# Altium project Digital-WeighingScale.PrjPcb
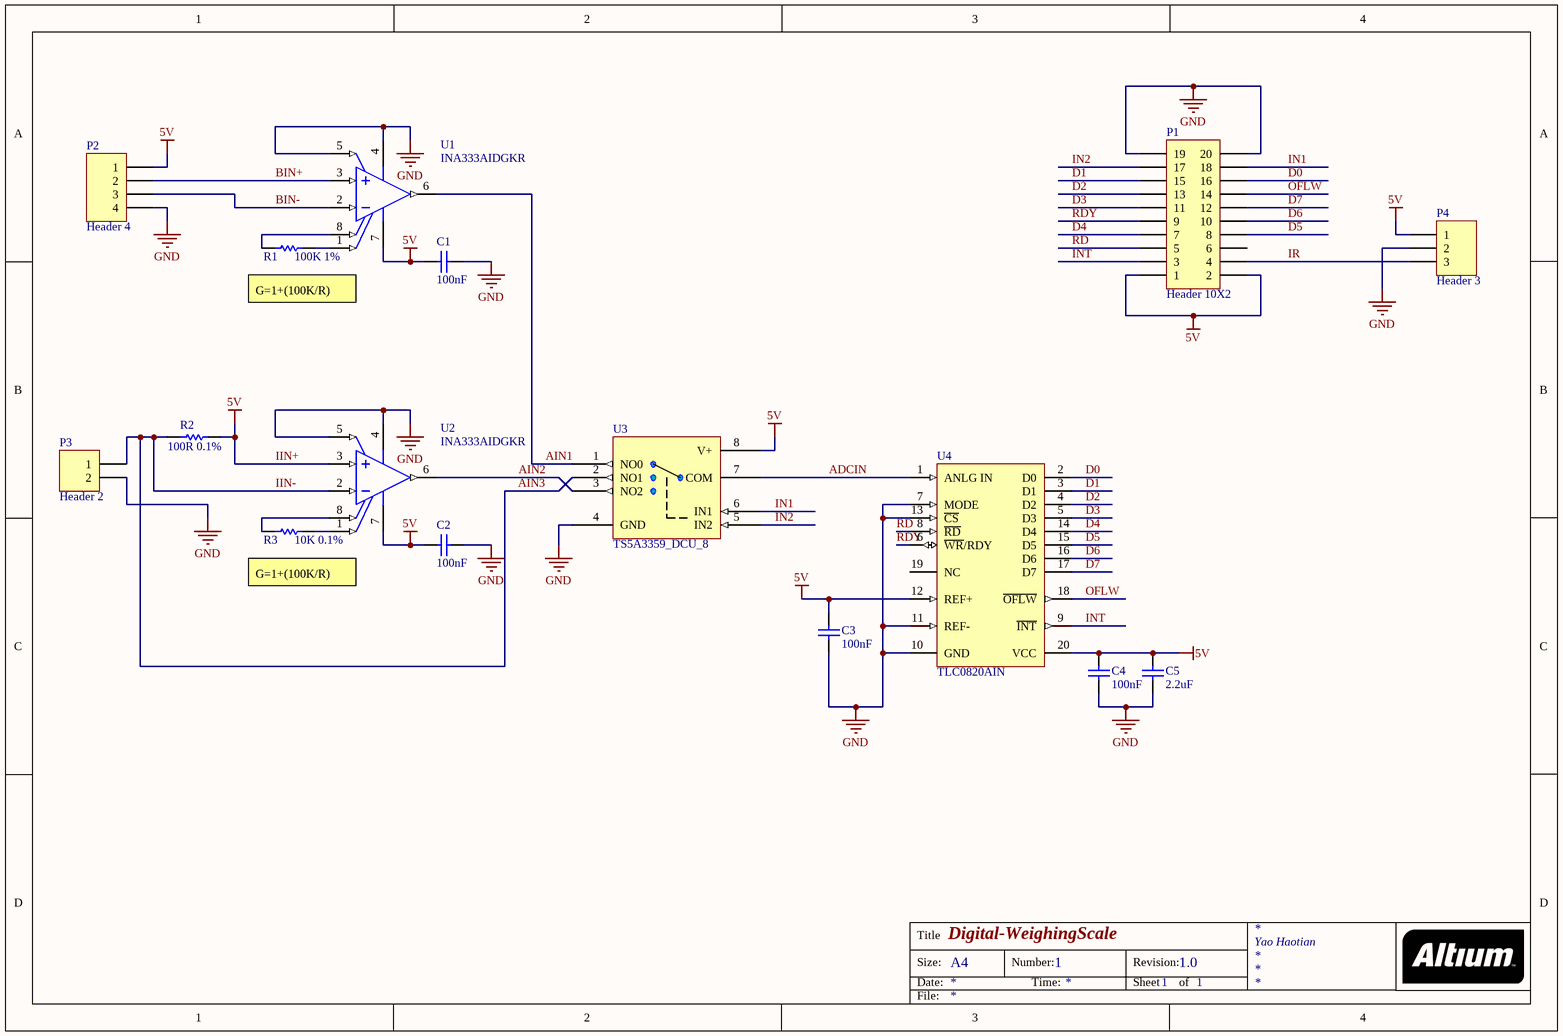
[diagram p0: Digital-WeighingScale.SchDoc]
1 sheet, 16 parts. Net scope: global (net labels, ports and power ports of the same name join across sheets).
Board file: Digital-WeighingScale.PcbDoc

## Sheet Digital-WeighingScale.SchDoc: Digital-WeighingScale
size A4; DrawnBy: Yao Haotian; Address1: Yao Haotian; DocumentNumber: 1; Revision: 1.0; SheetNumber: 1; SheetTotal: 1; ProjectName: Digital-WeighingScale

### Parts
C1  100nF  [CAPC0603(1608)100_M]
C2  100nF  [CAPC0603(1608)100_M]
C3  100nF  [CAPC0603(1608)100_M]
C4  100nF  [CAPC0603(1608)100_M]
C5  2.2uF  [CAPC0603(1608)100_M]
P1  Header 10X2  [HDR2X10]
P2  Header 4  [HDR1X4]
P3  Header 2  [HDR1X2]
P4  Header 3  [HDR1X3]
R1  100K 1%  [RESC0603(1608)_M]
R2  100R 0.1%  [RESC0603(1608)_M]
R3  10K 0.1%  [RESC0603(1608)_M]
U1  INA333AIDGKR  [TI-DGK8_L]
U2  INA333AIDGKR  [TI-DGK8_L]
U3  TS5A3359_DCU_8  [DCU8-M]
U4  TLC0820AIN  [TI-N20]

### Nets
5V: C1.2 C2.2 C3.1 C4.1 C5.1 P1.1 P1.2 P2.1 P4.1 R2.2 U1.7(V+) U2.3(VIN+) U2.7(V+) U3.8(V+) U4.12(REF+) U4.20(VCC)  [also labelled IIN+]
GND: C1.1 C2.1 C3.2 C4.2 C5.2 P1.19 P1.20 P2.4 P3.2 P4.2 U1.4(V-) U1.5(REF) U2.4(V-) U2.5(REF) U3.4(GND) U4.7(MODE) U4.10(GND) U4.11(REF-) U4.13(~{CS})
ADCIN: U3.7(COM) U4.1(ANLG_IN)
AIN1: U1.6(VOUT) U3.1(NO0)
AIN2: U2.6(VOUT) U3.3(NO2)
AIN3: P3.1 R2.1 U2.2(VIN-) U3.2(NO1)  [also labelled IIN-]
BIN+: P2.2 U1.3(VIN+)
BIN-: P2.3 U1.2(VIN-)
D0: P1.16 U4.2(D0)
D1: P1.15 U4.3(D1)
D2: P1.13 U4.4(D2)
D3: P1.11 U4.5(D3)
D4: P1.7 U4.14(D4)
D5: P1.8 U4.15(D5)
D6: P1.10 U4.16(D6)
D7: P1.12 U4.17(D7)
IN1: P1.18 U3.6(IN1)
IN2: P1.17 U3.5(IN2)
INT: P1.3 U4.9(~{INT})
IR: P1.4 P4.3
OFLW: P1.14 U4.18(~{OFLW})
RD: P1.5 U4.8(~{RD})
RDY: P1.9 U4.6(~{WR}/RDY)
NetR1_1: R1.1 U1.8(RG)
NetR1_2: R1.2 U1.1(RG)
NetR3_1: R3.1 U2.8(RG)
NetR3_2: R3.2 U2.1(RG)

Not connected (* = marked no-connect by the designer): P1 6; U4 19(NC)

### Notes on the sheet
- G=1+(100K/R)
- Title
- Size:
- Date:
- A4
- Number:
- Time:
- Revision:
- Sheet
- of
- File:

### Library data of the parts
C1-C4 = CMP-1035-02583-1: CAP 100nF 16V Â±5% 0603 (1608 Metric) Thickness 1mm SMD; Case-Metric: 1608; Case-EIA: 0603; Tolerance: Â±5%; Rated Voltage: 16 V; Max Thickness: 1 mm; Technology: SMT; Value: 100nF
C5 = CMP-1035-02583-1: CAP 2.2uF 16V Â±5% 0603 (1608 Metric) Thickness 1mm SMD; Case-Metric: 1608; Case-EIA: 0603; Tolerance: Â±5%; Rated Voltage: 16 V; Max Thickness: 1 mm; Technology: SMT; Value: 2.2uF
P1 = Header 10X2: Header, 10-Pin, Dual row; LatestRevisionDate: 17-Jul-2002; LatestRevisionNote: Re-released for DXP Platform.; Publisher: Altium Limited
P2 = Header 4: Header, 4-Pin; LatestRevisionDate: 17-Jul-2002; LatestRevisionNote: Re-released for DXP Platform.; Publisher: Altium Limited
P3 = Header 2: Header, 2-Pin; LatestRevisionDate: 17-Jul-2002; LatestRevisionNote: Re-released for DXP Platform.; Publisher: Altium Limited
P4 = Header 3: Header, 3-Pin; LatestRevisionDate: 17-Jul-2002; LatestRevisionNote: Re-released for DXP Platform.; Publisher: Altium Limited
R1 R3 = CMP-1012-00736-1: 100K 0.1W 1% 0603 (1608 Metric)  SMD; Value: 100000.00 Ohm; Case-Metric: 1608; Case-EIA: 0603; Power: 0.1 W; Tolerance: 1 %; Technology: SMT
R2 = CMP-1012-00510-1: 1K 0.1W 1% 0603 (1608 Metric)  SMD; Case-Metric: 1608; Case-EIA: 0603; Value: 1000.00 Ohm; Technology: SMT; Tolerance: 0.1 %; Power: 0.1 W
U1 U2 = CMP-0944-00088-1: Low Power, Precision Instrumentation Amplifier, -40 to 125 degC, 8-pin SOP (DGK8), Green (RoHS & no Sb/Br); Manufacturer: Texas Instruments; Vs(Min)(V): 1.8; Noise at 1kHz(Typ)(nV/rt(Hz)): 50; Output Offset Drift (+/-)(Max)(uV/Degrees Celsius): 0.5/G; Input Offset (+/-)(Max)(uV): 25; CMRR(Min)(dB): 100; SubFamily: Single Supply; Quiescent Current (+/-)(Typ)(mA): 0.05; Input Offset Drift (+/-)(Max)(uV/Degrees Celsius): 0.1; Gain(V/V): 1 to 1000; Input Bias Current (+/-)(Max)(nA): 0.2; Output Offset (+/-)(Max)(uV): 75/G; Number of Channels: 1; Vs(Max)(V): 5.5; ComponentLink2Description: Datasheet; DatasheetVersion: SBOS445B; ComponentLink1Description: Manufacturer URL; ComponentLink3Description: Package Specification; Code_JEDEC: MO-187; ComponentLink2URL: http://www.ti.com/general/docs/lit/getliterature.tsp?genericPartNumber=INA333&fileType=pdf; PackageVersion: 4073329/E, 05/2006; PartNumber: INA333AIDGKR; Mounting Technology: Surface Mount; ComponentLink3URL: http://www.ti.com/litv/pdf/mpds028d; Eco-Plan: Green (RoHS & no Sb/Br); PackageReference: DGK8; PackageDescription: 8-Pin Thin Small Outline, Body 3 x 3 mm, Pitch 0.65 mm; ComponentLink1URL: http://www.ti.com/
U3 = TS5A3359_DCU_8: Imported; Vendor: Texas Instruments; PACKAGE_DESIGNATOR: DCU; PIN_COUNT: 8; FAMILY_NAME: ANALOG SWITCH OR MULTIPLEXER (less than or equal to 5V); INDUSTRY_STD_PKG_TYPE: US8; Manufacturer_Part_Number: ts5a3359_dcu_8; GENERIC_PART_NUMBER: TS5A3359; Datasheet URL: http://www.ti.com/lit/gpn/TS5A3359; Manufacturer: Texas Instruments; RefDes: RefDes; Type: DEV; Value: Value
U4 = CMP-0003-01709-1: 8-Bit, 392 kSPS ADC Parallel Out, Microprocessor Peripheral, On-Chip Track-and-Hold, Single Channel, -40 to 85 degC, 20-pin DIP (N20), Pb-Free (RoHS); Manufacturer: Texas Instruments; Analog Voltage AV/DD(Min)(V): 4.5; Resolution(Bits): 8; Sample Rate (max)(SPS): 392k; Architecture: SAR; SubFamily: Precision ADC (<=10MSPS); Interface: Parallel CMOS; # Input Channels: 1; Code_JEDEC: MS-001; ComponentLink3Description: Package Specification; PartNumber: TLC0820AIN; Mounting Technology: Through Hole; ComponentLink2URL: http://www.ti.com/general/docs/lit/getliterature.tsp?genericPartNumber=TLC0820A&fileType=pdf; PackageVersion: 4040049/E, 12/2002; ComponentLink2Description: Datasheet; DatasheetVersion: SLAS064A; PackageDescription: 20-Pin Plastic In-Line, Body 25.40 x 6.35 mm, Pitch 2.54 mm; Eco-Plan: Pb-Free (RoHS); ComponentLink1Description: Manufacturer URL; ComponentLink1URL: http://www.ti.com/; ComponentLink3URL: http://www.ti.com/lit/ml/mpdi002c/mpdi002c.pdf; Digital Supply(Max)(V): 8; Digital Supply(Min)(V): 4.5; PackageReference: N20; Analog Voltage AV/DD(Max)(V): 8